# Altium project PCB_Project.PrjPcb
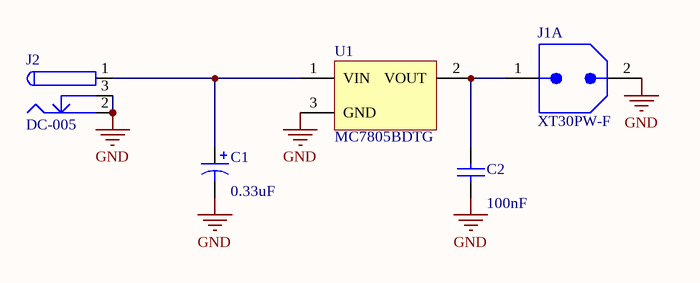
[diagram p0: 7805.SchDoc]
1 sheet, 5 parts. Net scope: global (net labels, ports and power ports of the same name join across sheets).
Board file: PCB1.PcbDoc

## Sheet 7805.SchDoc
size A4; SheetNumber: 1; SheetTotal: 1

### Parts
C1  value 0.33uF  [THT Electrolythic 5x11x2mm]  (hidden comment: Generic THT Electrolytic capacitor)
C2  value 100nF  [Generic THT Ceramic -Footprint-2]  (hidden comment: Generic THT Ceramic)
J1  XT30PW-F  [XT30 Female PCB Mount-Footprint-1]  (part A of 2)
J2  DC-005  [DC-0005-Footprint-1]
U1  MC7805BDTG  [DPAK229P991X238-3M]

### Nets
GND: C1.2 C2.1 J1.2 J2.2 J2.3 U1.3(GND)
NetC1_1: C1.1 J2.1 U1.1(VIN)
NetC2_2: C2.2 J1.1 U1.2(VOUT)

### Library data of the parts
C1 = CMP-0001-00007-3: Capacitor Type: Electrolythic; Case/Package: Various; Mount: THT; Pins: 2; RoHS: Yes
C2 = CMP-0001-00008-1: Generic Thruhole Ceramic Disc Capacitor; Case/Package: Thruhole; RoHS: Yes; Mount: THT; Capacitor Type: Ceramic
J1 = CMP-003-0034-4: XT30 BAT Connector Female PCB Mount
J2 = CMP-003-0019-1: DC Adapter Jack 2.0mm
U1 = CMP-ROOT-0006-2: ON SEMICONDUCTOR         MC7805BDTG            Linear Voltage Regulator, Fixed, Positive Voltage, 10V To 35V In, 5V And 1A Out, TO-252-3; Accuracy: 4%; Dropout Voltage: 2V; Number of Outputs: 1; Power Supply Rejection Ratio (PSRR): 68dB; Min Input Voltage: 7V; Quiescent Current: 8mA; Nominal Output Voltage: 5V; Contact Plating: Tin, Matte; Width: 6.22mm; REACH SVHC: No SVHC; Length: 6.73mm; Output Voltage Accuracy: 4%; Number of Pins: 3; Min Output Voltage: 5V; Current Rating: 1A; Max Output Current: 1A; Case/Package: DPAK; Packaging: Rail/Tube; Max Operating Temperature: 125°C; Number of Regulators: 1; Mount: Surface Mount; Output Voltage: 5V; Radiation Hardening: No; Height: 2.38mm; Package Quantity: 75; Halogen Free: Halogen Free; Operating Supply Voltage: 35V; Max Input Voltage: 35V; Lead Free: Lead Free; Min Operating Temperature: -40°C; Polarity: Positive; Output Current: 1A